# EasyEDA schematic JRC Board Mini Version1.0.json
TITLE: Sheet_1; REV: 1.0; Date: 2023-12-06; Sheet: 1/1; Drawn By: shakur_siam; Company: JRC 3.0 Test Version
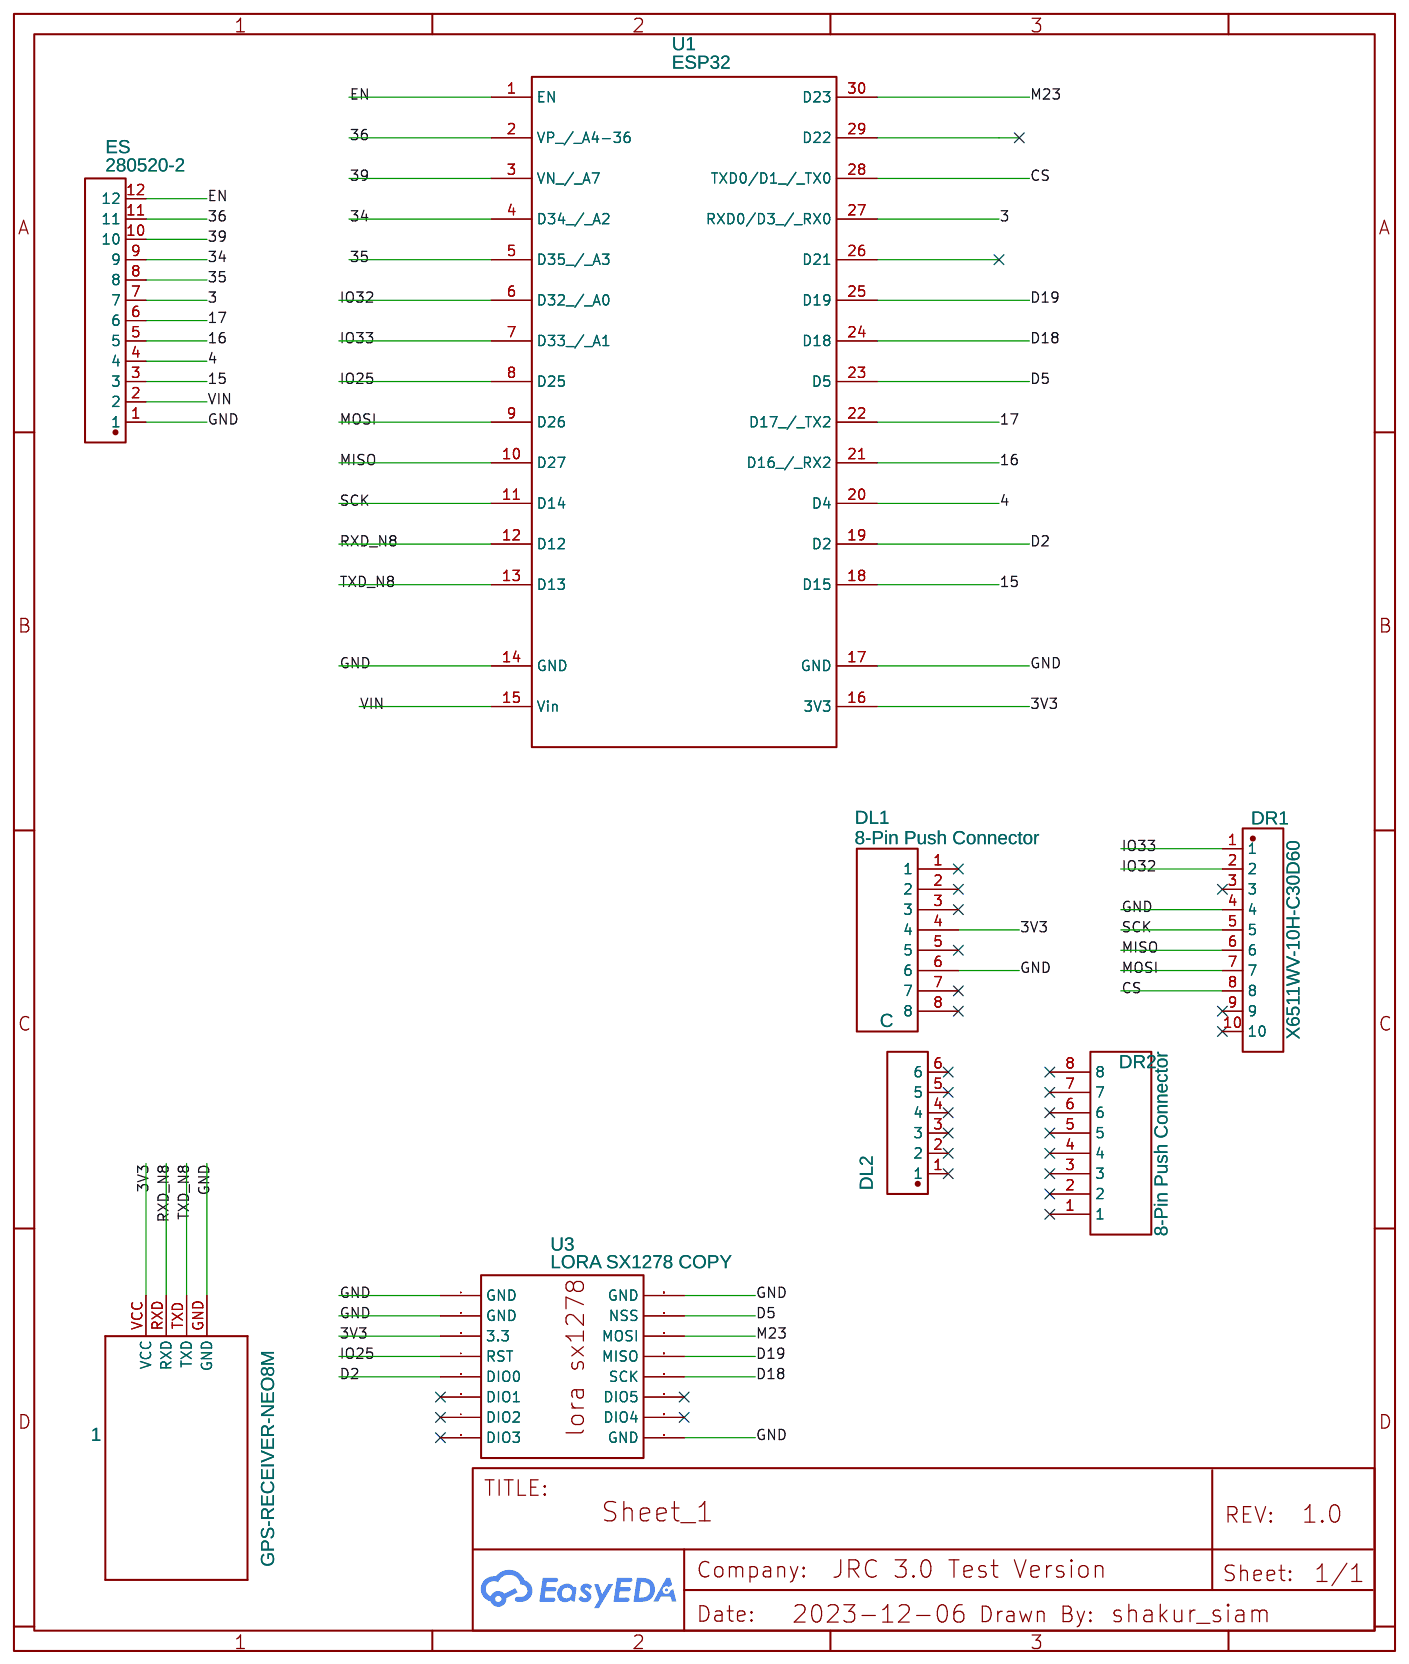
[diagram p0: schematic sheet]

## Parts
1  GPS-RECEIVER-NEO8M  [GPS-RECEIVER-NEO8M]
C  DL2  [CONNECTOR 6-PIN]
DL1  8-Pin Push Connector  [8-PIN PUSH CONNECTOR]
DR1  X6511WV-10H-C30D60  [HDR-TH_10P-P2.54-V-M]
DR2  8-Pin Push Connector  [8-PIN PUSH CONNECTOR]
ES  280520-2  [CONN-TH_12P-P2.54_280520-2]
U1  ESP32  [ESP32WROOM32]
U3  LORA SX1278 COPY  [LORA SX1278 UPDATE]

## Library data of the parts
1 = GPS-RECEIVER-NEO8M: Contributor: plainolddave
C = Connector 6-pin: Contributor: colebenedicto
DL1 DR2 = 8-Pin Push Connector: Contributor: madawson
DR1 = X6511WV-10H-C30D60: Supplier: LCSC; Supplier Part: C706882; Manufacturer: XKB Connectivity(中国星坤); Contributor: nazim debieb; JLCPCB Part Class: Extended Part
ES = 280520-2: Contributor: LCSC; Supplier: LCSC; Supplier Part: C306186; Manufacturer: TE Connectivity(泰科电子); JLCPCB Part Class: Extended Part
U1 = ESP32: Manufacturer: Espressif Systems; Supplier: AG ELECTRONICA; Supplier Part: ESP-WROOM-32; link: chrome-extension://efaidnbmnnnibpcajpcglclefindmkaj/https://agelectronica.lat/pdfs/textos/E/ESP-WROOM-32.PDF; Contributor: feroen
U3 = LORA SX1278 COPY: Contributor: vnrconnectindia

## Nets
3V3: 1.VCC DL1.4 U1.16(3V3) U3.3(3.3)
GND: 1.GND DL1.6 DR1.4 ES.1 U1.14(GND) U1.17(GND) U3.1(GND) U3.2(GND) U3.9(GND) U3.16(GND)
VIN: ES.2 U1.15(Vin)
3: ES.7 U1.27(RXD0/D3 / RX0)
4: ES.4 U1.20(D4)
15: ES.3 U1.18(D15)
16: ES.5 U1.21(D16 / RX2)
17: ES.6 U1.22(D17 / TX2)
34: ES.9 U1.4(D34 / A2)
35: ES.8 U1.5(D35 / A3)
36: ES.11 U1.2(VP / A4-36)
39: ES.10 U1.3(VN / A7)
CS: DR1.8 U1.28(TXD0/D1 / TX0)
D2: U1.19(D2) U3.5(DIO0)
D5: U1.23(D5) U3.15(NSS)
D18: U1.24(D18) U3.12(SCK)
D19: U1.25(D19) U3.13(MISO)
EN: ES.12 U1.1(EN)
IO25: U1.8(D25) U3.4(RST)
IO32: DR1.2 U1.6(D32 / A0)
IO33: DR1.1 U1.7(D33 / A1)
M23: U1.30(D23) U3.14(MOSI)
MISO: DR1.6 U1.10(D27)
MOSI: DR1.7 U1.9(D26)
RXD_N8: 1.RXD U1.12(D12)
SCK: DR1.5 U1.11(D14)
TXD_N8: 1.TXD U1.13(D13)

Not connected (* = marked no-connect by the designer): C 1* 2* 3* 4* 5* 6*; DL1 1* 2* 3* 5* 7* 8*; DR1 3* 9* 10*; DR2 1* 2* 3* 4* 5* 6* 7* 8*; U1 26(D21) 29(D22); U3 6(DIO1)* 7(DIO2)* 8(DIO3)* 10(DIO4)* 11(DIO5)*
